# Altium schematic sheet DMXController.SchDoc
size A4
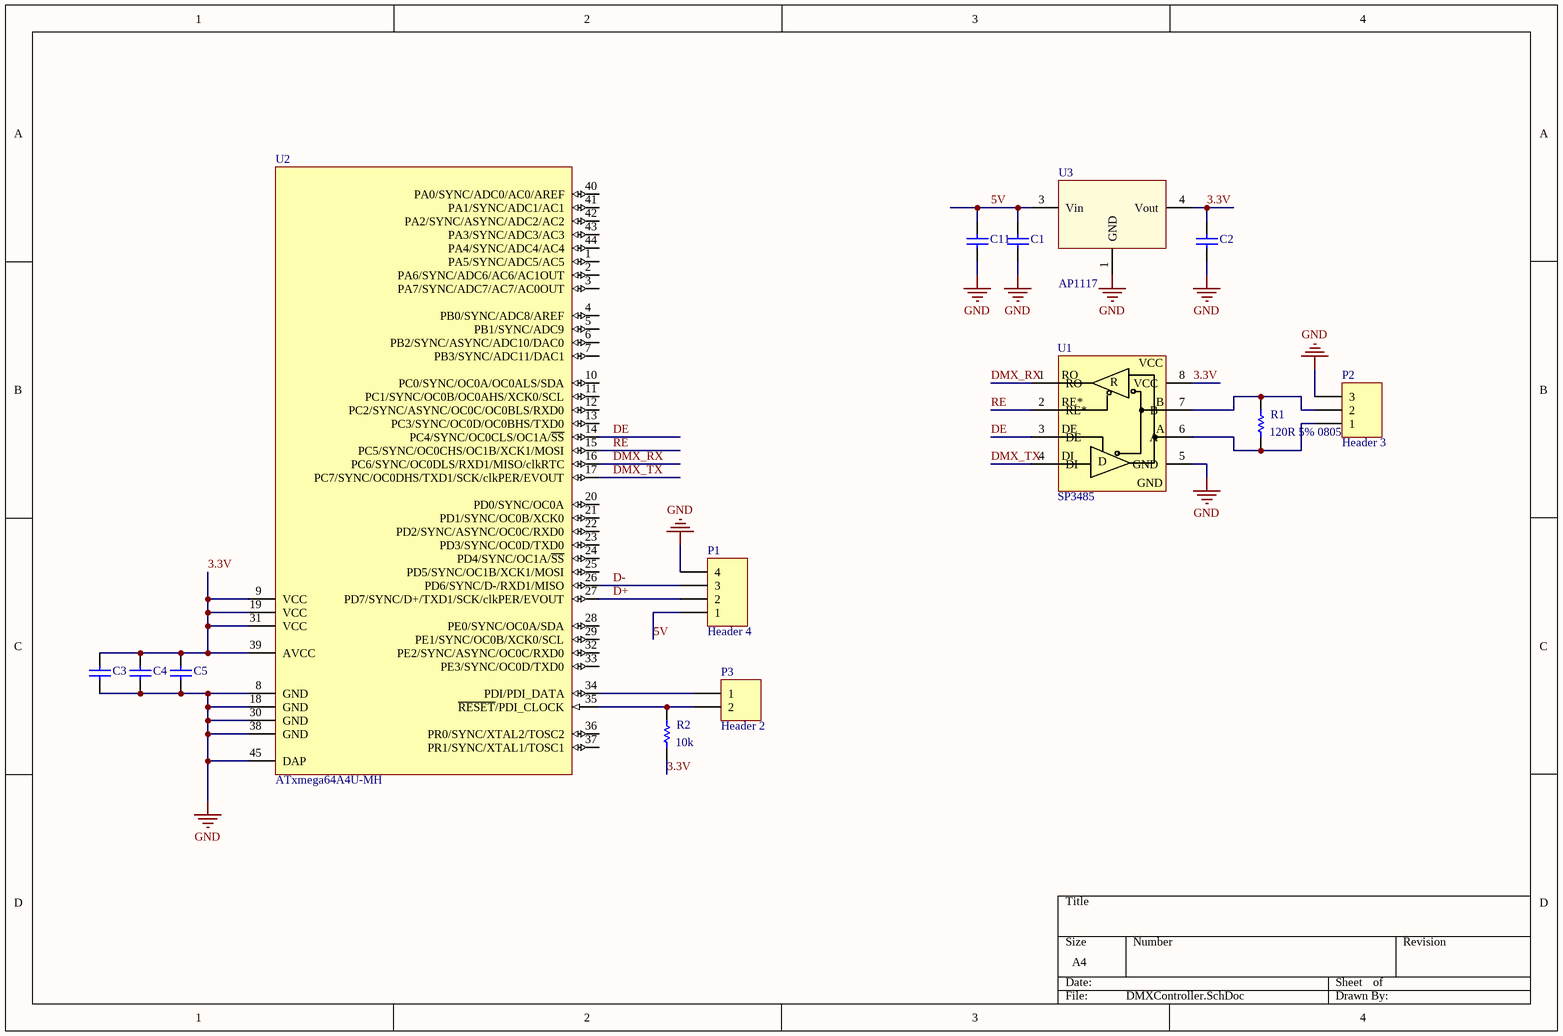
[diagram p0: DMXController.SchDoc]

## Parts
C1  10u  [CAPC0805(2012)100_M]  (value not drawn)
C2  22u  [CAPC0805(2012)100_M]  (value not drawn)
C3  100n  [CAPC0805(2012)100_M]  (value not drawn)
C4  100n  [CAPC0805(2012)100_M]  (value not drawn)
C5  100n  [CAPC0805(2012)100_M]  (value not drawn)
C11  10u  [CAPC0805(2012)100_M]  (value not drawn)
P1  Header 4  [HDR1X4]
P2  Header 3  [HDR1X3]
P3  Header 2  [HDR1X2]
R1  120R 5% 0805(2012)  [RESC0805(2012)_N]
R2  10k  [RESC0805(2012)_N]
U1  SP3485  [SOIC8]
U2  ATxmega64A4U-MH  [44M1_L]
U3  AP1117  [SOT-223]

## Nets
GND: C1.1 C2.1 C3.1 C4.1 C5.1 C11.1 P1.4 P2.3 U1.5(GND) U2.8(GND) U2.18(GND) U2.30(GND) U2.38(GND) U2.45(DAP) U3.1(GND)
3.3V: C2.2 C3.2 C4.2 C5.2 R2.1 U1.8(VCC) U2.9(VCC) U2.19(VCC) U2.31(VCC) U2.39(AVCC) U3.4(Vout)
5V: C1.2 C11.2 P1.1 U3.3(Vin)
D+: P1.2 U2.27(PD7/SYNC/D+/TXD1/SCK/clkPER/EVOUT)
D-: P1.3 U2.26(PD6/SYNC/D-/RXD1/MISO)
DE: U1.3(DE) U2.14(PC4/SYNC/OC0CLS/OC1A/~{SS})
DMX_RX: U1.1(RO) U2.16(PC6/SYNC/OC0DLS/RXD1/MISO/clkRTC)
DMX_TX: U1.4(DI) U2.17(PC7/SYNC/OC0DHS/TXD1/SCK/clkPER/EVOUT)
RE: U1.2(RE*) U2.15(PC5/SYNC/OC0CHS/OC1B/XCK1/MOSI)
NetP2_1: P2.1 R1.1 U1.6(A)
NetP2_2: P2.2 R1.2 U1.7(B)
NetP3_1: P3.1 U2.34(PDI/PDI_DATA)
NetP3_2: P3.2 R2.2 U2.35(~{RESET}/PDI_CLOCK)

Not connected (* = marked no-connect by the designer): U2 1(PA5/SYNC/ADC5/AC5) 2(PA6/SYNC/ADC6/AC6/AC1OUT) 3(PA7/SYNC/ADC7/AC7/AC0OUT) 4(PB0/SYNC/ADC8/AREF) 5(PB1/SYNC/ADC9) 6(PB2/SYNC/ASYNC/ADC10/DAC0) 7(PB3/SYNC/ADC11/DAC1) 10(PC0/SYNC/OC0A/OC0ALS/SDA) 11(PC1/SYNC/OC0B/OC0AHS/XCK0/SCL) 12(PC2/SYNC/ASYNC/OC0C/OC0BLS/RXD0) 13(PC3/SYNC/OC0D/OC0BHS/TXD0) 20(PD0/SYNC/OC0A) 21(PD1/SYNC/OC0B/XCK0) 22(PD2/SYNC/ASYNC/OC0C/RXD0) 23(PD3/SYNC/OC0D/TXD0) 24(PD4/SYNC/OC1A/~{SS}) 25(PD5/SYNC/OC1B/XCK1/MOSI) 28(PE0/SYNC/OC0A/SDA) 29(PE1/SYNC/OC0B/XCK0/SCL) 32(PE2/SYNC/ASYNC/OC0C/RXD0) 33(PE3/SYNC/OC0D/TXD0) 36(PR0/SYNC/XTAL2/TOSC2) 37(PR1/SYNC/XTAL1/TOSC1) 40(PA0/SYNC/ADC0/AC0/AREF) 41(PA1/SYNC/ADC1/AC1) 42(PA2/SYNC/ASYNC/ADC2/AC2) 43(PA3/SYNC/ADC3/AC3) 44(PA4/SYNC/ADC4/AC4)

## Notes on the sheet
- (in symbol SP3485) R; D

## Library data of the parts
C1-C5 C11 = CMP-1036-04739-1: CAP 1uF 10V ±10% 0805 (2012 Metric) Thickness 1mm SMD; Case-Metric: 2012; Case-EIA: 0805; Technology: SMT; Max Thickness: 1 mm; Value: 1uF; Tolerance: ±10%; Rated Voltage: 10 V
P1 = Header 4: Header, 4-Pin; LatestRevisionDate: 17-Jul-2002; LatestRevisionNote: Re-released for DXP Platform.; Publisher: Altium Limited
P2 = Header 3: Header, 3-Pin; LatestRevisionDate: 17-Jul-2002; LatestRevisionNote: Re-released for DXP Platform.; Publisher: Altium Limited
P3 = Header 2: Header, 2-Pin; LatestRevisionDate: 17-Jul-2002; LatestRevisionNote: Re-released for DXP Platform.; Publisher: Altium Limited
R1 R2 = CMP-1013-00052-1: 120R 0.125W 5% 0805 (2012 Metric)  SMD; Case-Metric: 2012; Value: 120.00 Ohm; Case-EIA: 0805; Tolerance: 5 %; Technology: SMT; Power: 0.125 W
U2 = CMP-0094-00055-1: 8/16-bit AVR XMEGA A4U Microcontroller, 1.6-3.6V, 32MHz, 64K + 4KB Flash, 2K EEPROM, 4K SRAM, 44-pin VQFN, Industrial Grade (-40°C to 85°C); PackageReference: 44M1; ComponentLink1Description: Manufacturer URL; Code_JEDEC: MO-220-VKKD-1; PackageDescription: 44-Pin Plastic Very Thin Quad Flat No-Lead Package, 7 x 7 x 1.0 mm Body, 0.5 mm Pitch (VQFN), 5.2 mm Exposed Pad; DatasheetVersion: revB, Dec-2011; ComponentLink2URL: http://www.atmel.com/dyn/resources/prod_documents/doc8387.pdf; PackageVersion: revH, Sep-2008; ComponentLink1URL: http://www.atmel.com/; ComponentLink2Description: ATxmega16A4U/32A4U/64A4U/128A4U Datasheet